# Altium project BLDC_FOC.PrjPcb
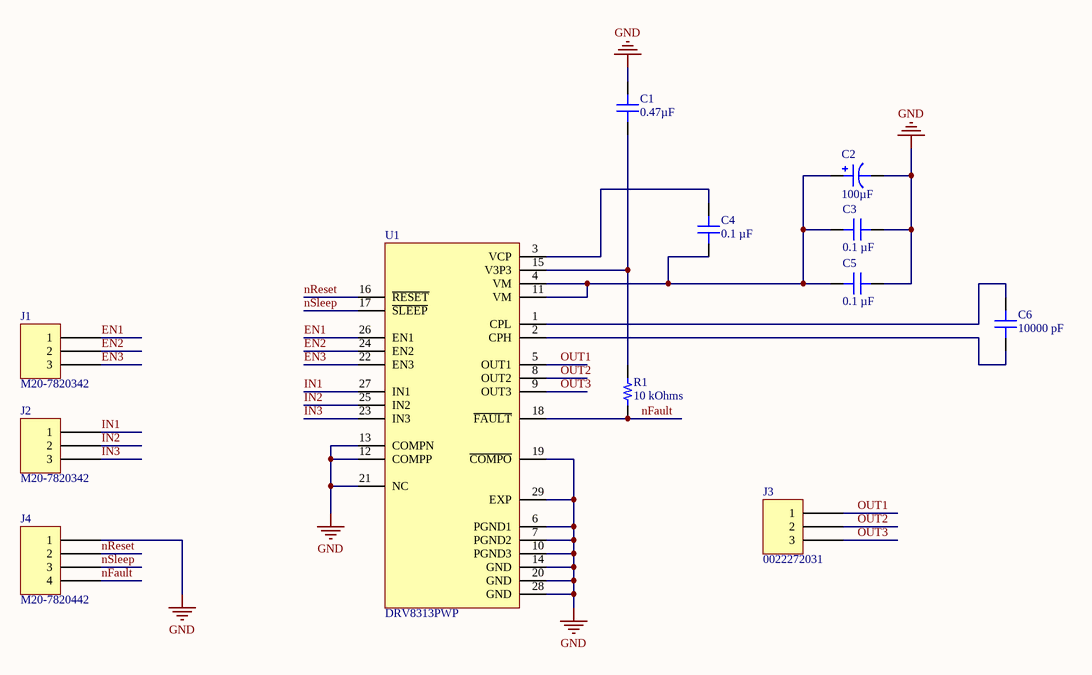
[diagram p0: Sheet1.SchDoc]
1 sheet, 12 parts. Net scope: global (net labels, ports and power ports of the same name join across sheets).
Board file: PCB1.PcbDoc

## Sheet Sheet1.SchDoc
size A4; SheetNumber: 1; SheetTotal: 1

### Parts
C1  0.47µF  [CAP 0805_2012]
C2  100µF  [CAP TH ALUM ELEC D10.00mm S5.00mm H12.50mm]
C3  0.1 µF  [CAP 0805_2012]
C4  0.1 µF  [CAP 0805_2012]
C5  0.1 µF  [CAP 0805_2012]
C6  10000 pF  [CAP 0805_2012]
J1  M20-7820342  [HARWIN M20-7820345]
J2  M20-7820342  [HARWIN M20-7820345]
J3  0022272031  [MOLEX KK 0022272031]
J4  M20-7820442  [HARWIN M20-7820445]
R1  10 kOhms  [RES 0805_2012]
U1  DRV8313PWP  [DRV8313]

### Nets
GND: C1.2 C2.2 C3.2 C5.2 J4.1 U1.6(PGND1) U1.7(PGND2) U1.10(PGND3) U1.12(COMPP) U1.13(COMPN) U1.14(GND) U1.19(~{COMPO}) U1.20(GND) U1.21(NC) U1.28(GND) U1.29(EXP)
EN1: J1.1 U1.26(EN1)
EN2: J1.2 U1.24(EN2)
EN3: J1.3 U1.22(EN3)
IN1: J2.1 U1.27(IN1)
IN2: J2.2 U1.25(IN2)
IN3: J2.3 U1.23(IN3)
nFault: J4.4 R1.2 U1.18(~{FAULT})
nReset: J4.2 U1.16(~{RESET})
nSleep: J4.3 U1.17(~{SLEEP})
OUT1: J3.1 U1.5(OUT1)
OUT2: J3.2 U1.8(OUT2)
OUT3: J3.3 U1.9(OUT3)
NetC1_1: C1.1 R1.1 U1.15(V3P3)
NetC2_1: C2.1 C3.1 C4.1 C5.1 U1.4(VM) U1.11(VM)
NetC4_2: C4.2 U1.3(VCP)
NetC6_1: C6.1 U1.2(CPH)
NetC6_2: C6.2 U1.1(CPL)

### Library data of the parts
C1 = MM053C474KCZ2A: CAP CER 0.47UF 25V X7R 0805; manufacturer: AVX Corporation; Tolerance: ±10%; Part Number: MM053C474KCZ2A; Value: 0.47µF; Applications: Medical, Non-Critical; Capacitance: 0.47µF; componentlink1description: Datasheet; componentlink1url: http://datasheets.avx.com/AVX-MM.pdf; componentlink2description: DigiKey Link; componentlink2url: http://digikey.com/product-detail/en/avx-corporation/MM053C474KCZ2A/478-10610-1-ND/7344871; Device Package: 0805 (2012 Metric); lastupdated: 2.09.2020 01:04:42; Lifecycle Status: Active; Minimum Order: 1; Mounting Type: Surface Mount, MLCC; Operating Temperature: -55°C ~ 125°C; Package / Case: 0805 (2012 Metric); packaging: TapeAndReel; partid: 2443; Part Status: Active; price: 0.50; series: MM; Size / Dimension: 0.079" L x 0.049" W (2.01mm x 1.25mm); Supplier 1: DigiKey; Supplier Part Number 1: 478-10610-1-ND; Temperature Coefficient: X7R; Thickness (Max): 0.029" (0.74mm); Voltage - Rated: 25V
C2 = EEU-FC1H101: CAP ALUM 100UF 20% 50V RADIAL; manufacturer: Panasonic Electronic Components; Impedance: 162 mOhms; Lifetime @ Temp.: 3000 Hrs @ 105°C; Polarization: Polar; Ripple Current @ High Frequency: 615mA @ 100kHz; Ripple Current @ Low Frequency: 399.75mA @ 120Hz; Part Number: EEU-FC1H101; Applications: Automotive; Capacitance: 100µF; componentlink1description: Datasheet; componentlink1url: http://industrial.panasonic.com/www-cgi/jvcr13pz.cgi?E+PZ+3+ABA0022+EEUFC1H101+7+WW; componentlink2description: DigiKey Link; componentlink2url: http://digikey.com/product-detail/en/panasonic-electronic-components/EEU-FC1H101/P10323-ND/266332; Device Package: Radial, Can; Height - Seated (Max): 0.492" (12.50mm); lastupdated: 2.09.2020 01:31:04; Lead Spacing: 0.197" (5.00mm); Lifecycle Status: Active; Minimum Order: 1; Mounting Type: Through Hole; Operating Temperature: -55°C ~ 105°C; Package / Case: Radial, Can; packaging: Bulk; partid: 10735; Part Status: Active; price: 0.48; Ratings: AEC-Q200; series: FC; Size / Dimension: 0.394" Dia (10.00mm); Supplier 1: DigiKey; Supplier Part Number 1: P10323-ND; Tolerance: ±20%; value: 100µF; Voltage - Rated: 50V
C3-C5 = 0805B104K250CT: CAP CER 0.1UF 25V X7R 0805; manufacturer: Walsin Technology Corporation; Tolerance: ±10%; Part Number: 0805B104K250CT; Value: 0.1 µF; Applications: General Purpose; Capacitance: 0.1 µF; componentlink1description: Datasheet; componentlink1url: http://www.passivecomponent.com/wp-content/uploads/2018/10/MLCC.pdf; componentlink2description: DigiKey Link; componentlink2url: https://www.digikey.com/en/products/detail/walsin-technology-corporation/0805B104K250CT/9355063; Device Package: 0805 (2012 Metric); lastupdated: 17.06.2023 19:19:53; Lifecycle Status: Active; Minimum Order: 1; Mounting Type: Surface Mount, MLCC; Operating Temperature: -55°C ~ 125°C; Package / Case: 0805 (2012 Metric); packaging: TapeAndReel; partid: 4879; Part Status: Active; price: 0.01; series: -; Size / Dimension: 0.079" L x 0.049" W (2.00mm x 1.25mm); Supplier 1: DigiKey; Supplier Part Number 1: 1292-1566-1-ND; Temperature Coefficient: X7R; Thickness (Max): 0.035" (0.90mm); Voltage - Rated: 25V
C6 = C0805C103J3GECAUTO: CAP CER 0805 10NF 25V C0G 5%; manufacturer: KEMET; Temperature Coefficient: C0G, NP0; Part Number: C0805C103J3GECAUTO; Value: 10000 pF; Applications: Automotive, ESD Protection; Capacitance: 10000 pF; componentlink1description: Datasheet; componentlink1url: https://api.kemet.com/component-edge/download/datasheet/C0805C103J3GECAUTO.pdf; componentlink2description: DigiKey Link; componentlink2url: https://www.digikey.com/en/products/detail/kemet/C0805C103J3GECAUTO/8647361; Device Package: 0805 (2012 Metric); Features: Low ESL; lastupdated: 17.06.2023 19:18:54; Lifecycle Status: Active; Minimum Order: 1; Mounting Type: Surface Mount, MLCC; Operating Temperature: -55°C ~ 125°C; Package / Case: 0805 (2012 Metric); packaging: TapeAndReel; partid: 32681; Part Status: Active; price: 0.05; Ratings: AEC-Q200; series: ESD SMD Auto C0G; Size / Dimension: 0.079" L x 0.049" W (2.00mm x 1.25mm); Supplier 1: DigiKey; Supplier Part Number 1: 399-C0805C103J3GECAUTOCT-ND; Thickness (Max): 0.039" (1.00mm); Tolerance: ±5%; Voltage - Rated: 25V
J1 J2 = M20-7820342: CONN RCPT 3POS 0.1 GOLD PCB; Manufacturer: Harwin Inc.; Connector Type: Receptacle; Contact Length - Post: 0.118" (3.00mm); Current Rating (Amps): 3A; Mated Stacking Heights: 11.04mm, 12.63mm; Material Flammability Rating: UL94 V-0; Number of Positions: 3; Number of Positions Loaded: All; Pitch - Mating: 0.100" (2.54mm); Style: Board to Board or Cable; Part Number: M20-7820342; ComponentLink1Description: Datasheet; ComponentLink1URL: https://cdn.harwin.com/pdfs/Harwin_PC_Connectors_M20.pdf; ComponentLink2Description: DigiKey Link; ComponentLink2URL: https://www.digikey.com/en/products/detail/harwin-inc/M20-7820342/3727752; Contact Finish - Mating: Gold; Contact Finish - Post: Tin; Contact Finish Thickness - Mating: Flash; Contact Type: Female Socket; Fastening Type: Push-Pull; Insulation Color: Black; Insulation Height: 0.335" (8.51mm); LastUpdated: 21.09.2022 18:55:13; Lifecycle Status: Active; Minimum Order: 1; Mounting Type: Through Hole; Number of Rows: 1; Operating Temperature: -40°C ~ 105°C; Packaging: Tube; Part Status: Active; Price: 0.42; Series: M20; Supplier 1: DigiKey; Supplier Part Number 1: 952-1783-ND; Termination: Solder
J3 = 0022272031: CONN HEADER VERT 3POS 2.54MM; Manufacturer: Molex; Contact Length - Mating: 0.295" (7.49mm); Contact Length - Post: 0.140" (3.56mm); Material Flammability Rating: UL94 V-0; Number of Positions: 3; Number of Positions Loaded: All; Overall Contact Length: 0.560" (14.22mm); Pitch - Mating: 0.100" (2.54mm); Shrouding: Shrouded - 1 Wall; Style: Board to Cable/Wire; Part Number: 0022272031; ComponentLink1Description: Datasheet; ComponentLink1URL: https://www.molex.com/pdm_docs/sd/022272031_sd.pdf; ComponentLink2Description: DigiKey Link; ComponentLink2URL: http://digikey.com/product-detail/en/molex/0022272031/WM4112-ND/1130578; Connector Type: Header; Contact Finish - Mating: Tin; Contact Finish - Post: Tin; Contact Finish Thickness - Mating: 100.0µin (2.54µm); Contact Material: Brass; Contact Shape: Square; Contact Type: Male Pin; Fastening Type: Friction Lock; Insulation Color: Natural; Insulation Height: 0.461" (11.70mm); Insulation Material: Polyamide (PA), Nylon; LastUpdated: 12.01.2020 23:51:54; Lifecycle Status: Active; Minimum Order: 1; Mounting Type: Through Hole; Number of Rows: 1; Packaging: Bulk; PartId: 77; Part Status: Active; Price: 0.37; Series: KK 6410; Supplier 1: DigiKey; Supplier Part Number 1: WM4112-ND; Termination: Solder
J4 = M20-7820442: CONN RCPT 4POS 0.1 GOLD PCB; Manufacturer: Harwin Inc.; Connector Type: Receptacle; Contact Length - Post: 0.118" (3.00mm); Current Rating (Amps): 3A; Mated Stacking Heights: 11.04mm, 12.63mm; Material Flammability Rating: UL94 V-0; Number of Positions: 4; Number of Positions Loaded: All; Pitch - Mating: 0.100" (2.54mm); Style: Board to Board or Cable; Part Number: M20-7820442; ComponentLink1Description: Datasheet; ComponentLink1URL: https://cdn.harwin.com/pdfs/Harwin_PC_Connectors_M20.pdf; ComponentLink2Description: DigiKey Link; ComponentLink2URL: https://www.digikey.com/en/products/detail/harwin-inc/M20-7820442/3727760; Contact Finish - Mating: Gold; Contact Finish - Post: Tin; Contact Finish Thickness - Mating: Flash; Contact Type: Female Socket; Fastening Type: Push-Pull; Insulation Color: Black; Insulation Height: 0.335" (8.51mm); LastUpdated: 21.09.2022 18:57:11; Lifecycle Status: Active; Minimum Order: 1; Mounting Type: Through Hole; Number of Rows: 1; Operating Temperature: -40°C ~ 105°C; Packaging: Tube; Part Status: Active; Price: 0.45; Series: M20; Supplier 1: DigiKey; Supplier Part Number 1: 952-1791-ND; Termination: Solder
R1 = RNCP0805FTD10K0: RES 10K OHM 1% 1/4W 0805; Manufacturer: Stackpole Electronics Inc; Power (Watts): 0.25W, 1/4W; Temperature Coefficient: ±100ppm/°C; Part Number: RNCP0805FTD10K0; Value: 10 kOhms; ComponentLink1Description: Datasheet; ComponentLink1URL: https://www.seielect.com/catalog/sei-rncp.pdf; ComponentLink2Description: DigiKey Link; ComponentLink2URL: https://www.digikey.com/en/products/detail/stackpole-electronics-inc/RNCP0805FTD10K0/2240262; Composition: Thin Film; Device Package: 0805 (2012 Metric); Features: Anti-Sulfur; Height - Seated (Max): 0.025" (0.65mm); LastUpdated: 17.06.2023 19:59:23; Lifecycle Status: Active; Minimum Order: 1; Number of Terminations: 2; Operating Temperature: -55°C ~ 155°C; Package / Case: 0805 (2012 Metric); Packaging: TapeAndReel; PartId: 28021; Part Status: Active; Price: 0.01; Resistance: 10 kOhms; Series: RNCP; Size / Dimension: 0.079" L x 0.049" W (2.00mm x 1.25mm); Supplier 1: DigiKey; Supplier Part Number 1: RNCP0805FTD10K0CT-ND; Supplier Device Package: 0805; Tolerance: ±1%
U1 = DRV8313PWP: Motor Driver Power MOSFET Parallel 28-HTSSOP; Manufacturer: Texas Instruments; Manufacturer Part Number: DRV8313PWPR; Number of Outputs: 1; Output Current: 1.75A; Min Supply Voltage: 8V; Max Supply Voltage: 60V; Supplier 1: Mouser; RoHS: Yes; Category: Motor Drivers; Stock 1: 1916; Pricing 1: 1=3,73, 10=3,35, 50=3,16, 100=2,74, 1000=1,99, 10000=1,92 (USD); Mount: Surface Mount; Case/Package: HTSSOP; Number of Pins: 28; Min Operating Temperature: -40°C; Max Operating Temperature: 125°C; Packaging: Tape and Reel; Package Quantity: 2000; Series: -; Interface: Parallel; Lead Free: Lead Free; RoHS Compliant: Yes; ComponentLink1URL: https://datasheet.ciiva.com/24105/slvsba5a-261520-24105611.pdf?src-supplier=Mouser; ComponentLink1Description: https://datasheet.ciiva.com/24105/slvsba5a-261520-24105611.pdf?src-supplier=Mouser; ComponentLink2URL: https://datasheet.ciiva.com/6607/drv8313-6607795.pdf?src-supplier=Digi-Key; ComponentLink2Description: https://datasheet.ciiva.com/6607/drv8313-6607795.pdf?src-supplier=Digi-Key; Supplier Part Number 1: 595-DRV8313PWPR